# Altium project tester_board.PrjPCB (part 2 of 4)

## Sheet charge_pump.SchDoc: Charge Pump
size A; Engineer: A. Peck; Organization: UCLA High Energy Physics; DocumentNumber: 15; Revision: 3.0; SheetNumber: 15; SheetTotal: 15; Project: LCT Comparator Tester; ProjectName: LCT Comparator Tester
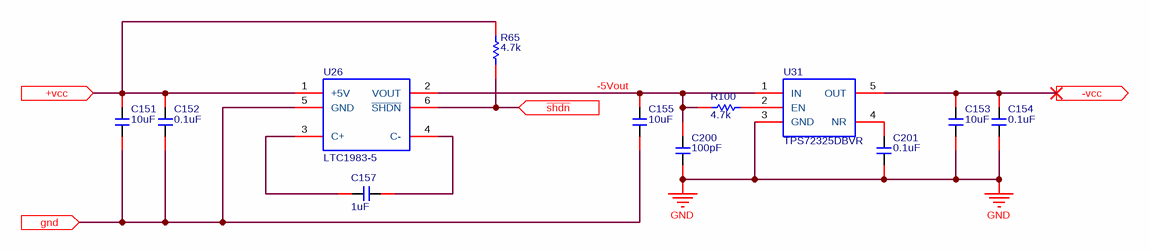
[diagram p3: charge_pump.SchDoc]

### Parts
C151  10uF  [c1206]
C152  0.1uF  [C0603]
C153  10uF  [c1206]
C154  0.1uF  [C0603]
C155  10uF  [c1206]
C157  1uF  [C0603]
C200  100pF  [C0603]
C201  0.1uF  [C0603]
R65  4.7k  [R0603]
R100  4.7k  [R0603]
U26  LTC1983-5  [sot23-6]
U31  TPS72325DBVR  [SOT23-5]

### Ports
+vcc (in), -vcc (out), gnd (in), ~{shdn} (in)

### Nets
+5VA: C151.2 C152.2 R65.2 U26.1(+5V) ; port +vcc
-5VA: C153.2 C154.2 U31.5(OUT) ; port -vcc
GND: C151.1 C152.1 C153.1 C154.1 C155.2 C200.1 C201.1 U26.5(GND) U31.3(GND) ; port gnd
-5Vout: C155.1 C200.2 R100.2 U26.2(VOUT) U31.1(IN)
NetC157_1: C157.1 U26.3(C+)
NetC157_2: C157.2 U26.4(C-)
NetC201_2: C201.2 U31.4(NR)
NetR65_1: R65.1 U26.6(~{SHDN}) ; port ~{shdn}
NetR100_1: R100.1 U31.2(EN)

### Notes on the sheet
- Date:
- Rev:
- of
- Sheet

### Library data of the parts
C151 C153 C155 = CAP/GMK316F106ZL-T: CAP-CER, 2, 10uF, 10%, 35V, 1206; Manufacturer: Taiyo Yuden; Capacitance: 10µF; Tolerance: -20%, +80%; Temperature Coefficient: Y5V (F); Supplier 1: Digi-Key; Supplier Part Number 1: 587-1352-1-ND; Manufacturer Part Number: GMK316F106ZL-T; RoHS: RoHS Compliant; Category: Capacitors; Stock 1: 249989; Pricing 1: 1=0.46, 10=0.345, 50=0.2012, 100=0.161, 250=0.115, 500=0.0782, 1000=0.06325 (USD); Packaging: Cut Tape (CT); Voltage - Rated: 35V; Mounting Type: Surface Mount, MLCC; Operating Temperature: -30°C ~ 85°C; Applications: General Purpose; Ratings: -; Package / Case: 1206 (3216 Metric); Size / Dimension: 0.126" L x 0.063" W (3.20mm x 1.60mm); Height - Seated (Max): -; Thickness (Max): 0.071" (1.80mm); Lead Spacing: -; Features: -; Lead Style: -; ComponentLink1URL: http://ds.yuden.co.jp/TYCOMPAS/ut/detail.do?productNo=GMK316F106ZL-T&fileName=GMK316F106ZL-T_SS&mode=specSheetDownload; ComponentLink1Description: http://ds.yuden.co.jp/TYCOMPAS/ut/detail.do?productNo=GMK316F106ZL-T&fileName=GMK316F106ZL-T_SS&mode=specSheetDownload
C152 C154 C201 = CAP/06035C104KAT2A: CAP-CER, 2, 0.1uF, 10%, 50V, 0603, X7R; Manufacturer: AVX Corporation; Capacitance: 0.10µF; Supplier 1: Digi-Key; Supplier Part Number 1: 478-5052-1-ND; Manufacturer Part Number: 06035C104KAT2A; RoHS: RoHS Compliant; Category: Capacitors; Stock 1: 4412408; Pricing 1: 1=0.1, 10=0.036, 25=0.0264, 50=0.0198, 100=0.0162, 250=0.01352, 500=0.01156, 1000=0.00908 (USD); Packaging: Cut Tape (CT); Tolerance: ±10%; Voltage - Rated: 50V; Temperature Coefficient: X7R; Mounting Type: Surface Mount, MLCC; Operating Temperature: -55°C ~ 125°C; Applications: General Purpose; Ratings: -; Package / Case: 0603 (1608 Metric); Size / Dimension: 0.063" L x 0.032" W (1.60mm x 0.81mm); Height - Seated (Max): -; Thickness (Max): 0.035" (0.90mm); Lead Spacing: -; Features: -; Lead Style: -; ComponentLink1URL: http://datasheets.avx.com/X7RDielectric.pdf; ComponentLink1Description: http://datasheets.avx.com/X7RDielectric.pdf; Supplier 2: Newark; Supplier Part Number 2: 54K2412
C157 = Murata/GRM188R61E105KA12D: CAP-CER, 2, 1.0uF, 10%, 25V, 0603; Manufacturer: Murata Electronics North America; Capacitance: 1µF; Temperature Coefficient: X5R; Supplier 1: Digi-Key; Supplier Part Number 1: 490-3897-1-ND; Manufacturer Part Number: GRM188R61E105KA12D; RoHS: RoHS Compliant; Category: Capacitors; Stock 1: 1899119; Pricing 1: 1=0.1, 10=0.036, 50=0.0196, 100=0.0165, 250=0.01352, 500=0.01156, 1000=0.009 (USD); Packaging: Cut Tape (CT); Tolerance: ±10%; Voltage - Rated: 25V; Mounting Type: Surface Mount, MLCC; Operating Temperature: -55°C ~ 85°C; Applications: General Purpose; Ratings: -; Package / Case: 0603 (1608 Metric); Size / Dimension: 0.063" L x 0.031" W (1.60mm x 0.80mm); Height - Seated (Max): -; Thickness (Max): 0.035" (0.90mm); Lead Spacing: -; Features: -; Lead Style: -; ComponentLink1URL: http://www.murata.com/~/media/webrenewal/support/library/catalog/products/capacitor/mlcc/c02e.pdf; ComponentLink1Description: http://www.murata.com/~/media/webrenewal/support/library/catalog/products/capacitor/mlcc/c02e.pdf
C200 = AVX/06035A101KAT2A: CAP-CER, 0, 100pF, 10%, 50V, 0603; Manufacturer: AVX Corporation; Temperature Coefficient: C0G, NP0; Supplier 1: Digi-Key; Supplier Part Number 1: 478-3717-1-ND; Manufacturer Part Number: 06035A101KAT2A; RoHS: RoHS Compliant; Category: Capacitors; Stock 1: 55355; Pricing 1: 1=0.16, 10=0.117, 25=0.0856, 50=0.0664, 100=0.0551, 250=0.04556, 500=0.03862, 1000=0.03197 (USD); Packaging: Cut Tape (CT); Part Status: Active; Capacitance: 100pF; Tolerance: ±10%; Voltage - Rated: 50V; Operating Temperature: -55°C ~ 125°C; Features: -; Ratings: -; Applications: General Purpose; Failure Rate: *; Mounting Type: Surface Mount, MLCC; Package / Case: 0603 (1608 Metric); Size / Dimension: 0.063" L x 0.032" W (1.60mm x 0.81mm); Height - Seated (Max): -; Thickness (Max): 0.035" (0.90mm); Lead Spacing: -; Lead Style: -; ComponentLink1URL: http://catalogs.avx.com/SurfaceMount.pdf; ComponentLink1Description: http://catalogs.avx.com/SurfaceMount.pdf
R65 R100 = CRCW06034K70FKEA: RES1, SMD, 4.70k, 1.0%, 1/10W, 0603; Manufacturer: Vishay Dale; Tolerance: ±1%; Power (Watts): 0.1W, 1/10W; Temperature Coefficient: ±100ppm/°C; Supplier 1: Digi-Key; Manufacturer Part Number: CRCW06034K70FKEA; RoHS: RoHS Compliant; Category: Resistors; Stock 1: 413202; Pricing 1: 1=0.1, 10=0.03, 25=0.022, 50=0.0168, 100=0.0123, 250=0.0094, 500=0.00752, 1000=0.00554, 2500=0.00481 (USD); Packaging: Cut Tape (CT); Resistance (Ohms): 4.7k; Composition: Thick Film; Features: Automotive AEC-Q200; Operating Temperature: -55°C ~ 155°C; Package / Case: 0603 (1608 Metric); Supplier Device Package: 0603; Size / Dimension: 0.063" L x 0.033" W (1.60mm x 0.85mm); Number of Terminations: 2; ComponentLink1URL: http://www.vishay.com/docs/20035/dcrcwe3.pdf; ComponentLink1Description: http://www.vishay.com/docs/20035/dcrcwe3.pdf; Supplier Part Number 1: 541-4.70KHCT-ND; Part Status: Active; Height - Seated (Max): 0.020" (0.50mm); Failure Rate: -
U26 = LT/LTC1983-5: REG, Charge Pump, Inverting, 100mA, -5V; Manufacturer: Linear Technology; Manufacturer Part Number: LTC1983ES6-5#TRMPBF; Function: Step-Up/Step-Down; Output Configuration: Negative; Output Type: Fixed; Number of Outputs: 1; Voltage - Input (Min): 2.3V; Voltage - Input (Max): 5.5V; Frequency - Switching: 900kHz; Synchronous Rectifier: No; Supplier 1: Digi-Key; RoHS: RoHS Compliant; Category: Integrated Circuits (ICs); Stock 1: 13395; Pricing 1: 1=4.28, 25=3.8192, 100=3.4371 (USD); Packaging: Cut Tape (CT); Topology: Charge Pump; Voltage - Output (Min/Fixed): -5V; Voltage - Output (Max): -; Current - Output: 100mA; Operating Temperature: -40°C ~ 85°C (TA); Mounting Type: Surface Mount; Package / Case: SOT-23-6 Thin, TSOT-23-6; Supplier Device Package: TSOT-23-6; ComponentLink1URL: http://www.linear.com/docs/2135; ComponentLink1Description: http://www.linear.com/docs/2135; Supplier Part Number 1: LTC1983ES6-5#TRMPBFCT-ND
U31 = TPS72325DBVR: LDO, Neg -2.5V, 200mA; Manufacturer: Texas Instruments; Regulator Topology: Negative Fixed; Voltage - Dropout (Typical): 0.28V @ 200mA; Number of Regulators: 1; Voltage - Input: -2.7 V ~ -10 V; Current - Limit (Min): 300mA; Supplier 1: Digi-Key; Manufacturer Part Number: TPS72325DBVR; RoHS: RoHS Compliant; Category: Integrated Circuits (ICs); Stock 1: 2132; Pricing 1: 1=2.87, 10=2.58, 100=2.0696, 500=1.701, 1000=1.18125 (USD); Packaging: Cut Tape (CT); Part Status: Active; Voltage - Output: -2.5V; Current - Output: 200mA; Operating Temperature: -40°C ~ 125°C; Mounting Type: Surface Mount; Package / Case: SC-74A, SOT-753; Supplier Device Package: SOT-23-5; ComponentLink1URL: http://www.ti.com/lit/ds/symlink/tps723.pdf; ComponentLink1Description: http://www.ti.com/lit/ds/symlink/tps723.pdf; Supplier Part Number 1: 296-39479-1-ND

## Sheet spartan6.SchDoc: Spartan-6 FPGA
size B; Engineer: A. Peck; Organization: UCLA High Energy Physics; DocumentNumber: 4; Revision: 3.0; SheetNumber: 4; SheetTotal: 15; Project: LCT Comparator Tester
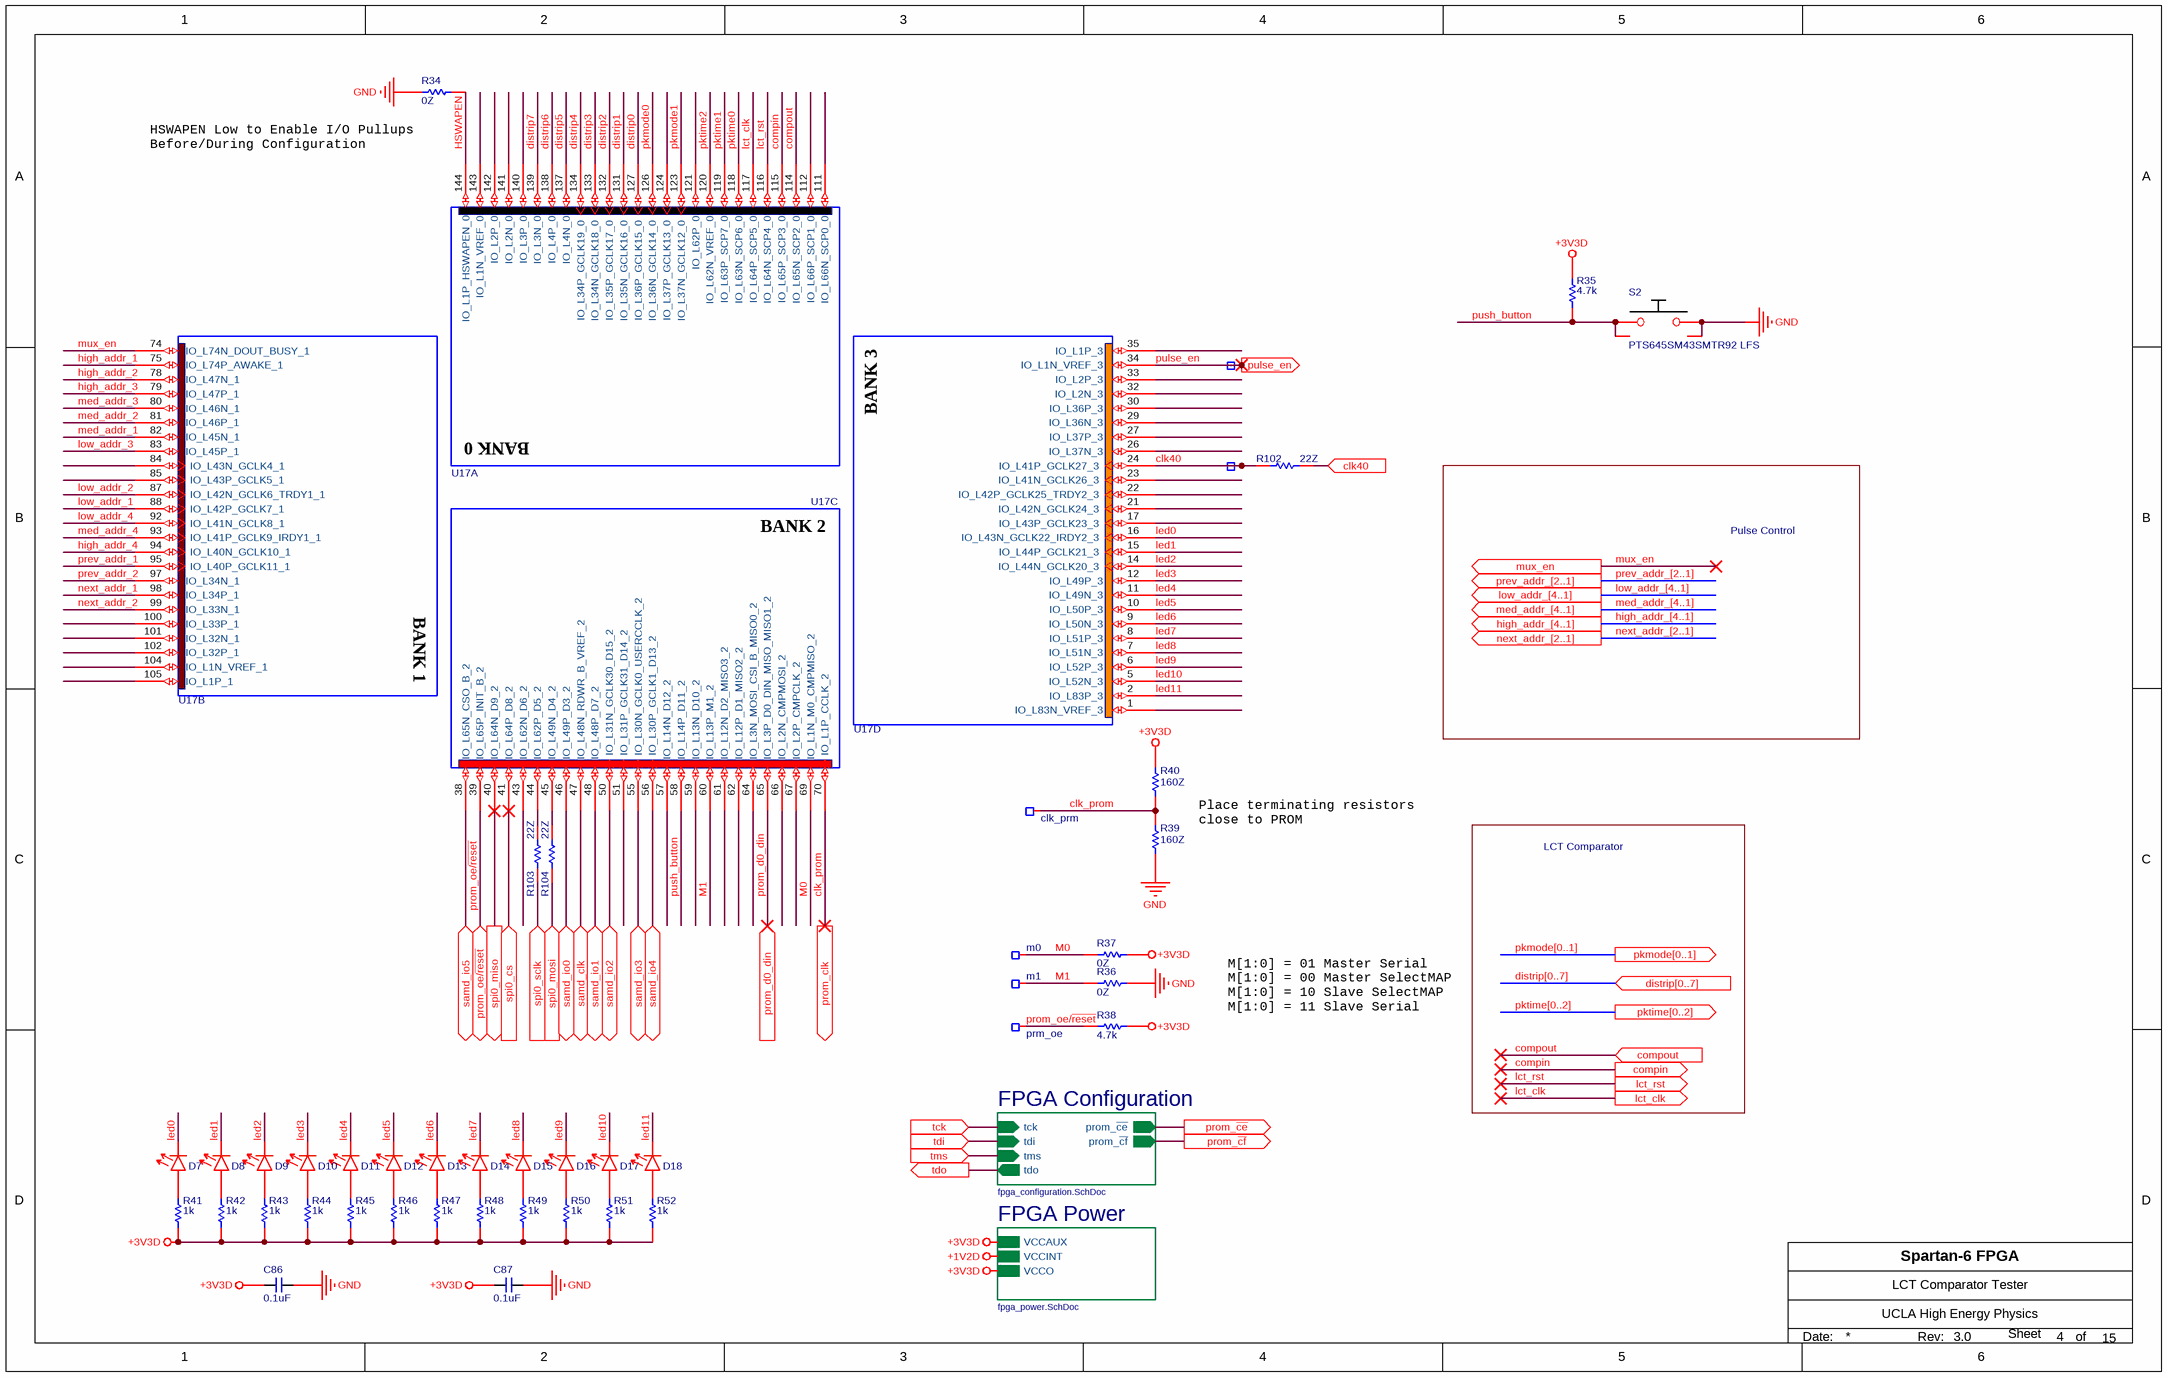
[diagram p4: spartan6.SchDoc]

### Parts
C86  0.1uF  [C0603]
C87  0.1uF  [C0603]
D7  Vishay/TLMS1000-GS08  [LED0603]  (value not drawn)
D8  Vishay/TLMS1000-GS08  [LED0603]  (value not drawn)
D9  Vishay/TLMS1000-GS08  [LED0603]  (value not drawn)
D10  Vishay/TLMS1000-GS08  [LED0603]  (value not drawn)
D11  Vishay/TLMS1000-GS08  [LED0603]  (value not drawn)
D12  Vishay/TLMS1000-GS08  [LED0603]  (value not drawn)
D13  Vishay/TLMS1000-GS08  [LED0603]  (value not drawn)
D14  Vishay/TLMS1000-GS08  [LED0603]  (value not drawn)
D15  Vishay/TLMS1000-GS08  [LED0603]  (value not drawn)
D16  Vishay/TLMS1000-GS08  [LED0603]  (value not drawn)
D17  Vishay/TLMS1000-GS08  [LED0603]  (value not drawn)
D18  Vishay/TLMS1000-GS08  [LED0603]  (value not drawn)
R34  0Z  [R0603]
R35  4.7k  [R0603]
R36  0Z  [R0603]
R37  0Z  [R0603]
R38  4.7k  [R0603]
R39  160Z  [R0603]
R40  160Z  [R0603]
R41  1k  [R0603]
R42  1k  [R0603]
R43  1k  [R0603]
R44  1k  [R0603]
R45  1k  [R0603]
R46  1k  [R0603]
R47  1k  [R0603]
R48  1k  [R0603]
R49  1k  [R0603]
R50  1k  [R0603]
R51  1k  [R0603]
R52  1k  [R0603]
R102  22Z  [R0402]
R103  22Z  [R0402]
R104  22Z  [R0402]
S2  PTS645SM43SMTR92 LFS  [C&K PTS645]
TP22  pulse_en  [TP_MICRO]  (value not drawn)  (no BOM)
TP23  m1  [TP_MICRO]  (no BOM)
TP24  m0  [TP_MICRO]  (no BOM)
TP25  prm_oe  [TP_MICRO]  (no BOM)
TP26  clk_prm  [TP_MICRO]  (no BOM)
TP32  clk40  [TP_MICRO]  (value not drawn)  (no BOM)
U17  XC6SLX4-2TQG144C  [TQFP-144]  (value not drawn)  (parts A,B,C,D of 7)

### Sub-sheets
FPGA Configuration = fpga_configuration.SchDoc: prom_~{ce} (out), prom_~{cf} (out), tck (in), tdi (in), tdo (out), tms (in)
FPGA Power = fpga_power.SchDoc: VCCAUX, VCCINT, VCCO

### Ports
clk40 (in), compin (out), compout (in), distrip[0..7] (in), high_addr_[4..1] (out), lct_clk (out), lct_rst (out), low_addr_[4..1] (out), med_addr_[4..1] (out), mux_en (out), next_addr_[2..1] (out), pkmode[0..1] (out), pktime[0..2] (out), prev_addr_[2..1] (out), prom_clk (out), prom_d0_din (in), prom_oe/~{reset} (bidir), prom_~{ce} (out), prom_~{cf} (out), pulse_en (out), samd_clk (bidir), samd_io0 (bidir), samd_io1 (bidir), samd_io2 (bidir), samd_io3 (bidir), samd_io4 (bidir), samd_io5 (bidir), spi0_cs (in), spi0_miso (out), spi0_mosi (in), spi0_sclk (in), tck (in), tdi (in), tdo (out), tms (in)

### Nets
+3V3D: C86.1 C87.1 R35.2 R37.2 R38.2 R40.1 R41.1 R42.1 R43.1 R44.1 R45.1 R46.1 R47.1 R48.1 R49.1 R50.1 R51.1 R52.1 ; sheet FPGA Power/VCCAUX, sheet FPGA Power/VCCO
GND: C86.2 C87.2 R34.1 R36.2 R39.1 S2.3 S2.4
clk40: R102.1 TP32.1 U17.24(IO_L41P_GCLK27_3)
clk_in: U17.47(IO_L48N_RDWR_B_VREF_2) ; port samd_clk
clk_prom: R39.2 R40.2 TP26.1 U17.70(IO_L1P_CCLK_2) ; port prom_clk
compin: U17.115(IO_L65P_SCP3_0) ; port compin
compout: U17.114(IO_L65N_SCP2_0) ; port compout
distrip0: U17.127(IO_L36P_GCLK15_0)
distrip1: U17.131(IO_L35N_GCLK16_0)
distrip2: U17.132(IO_L35P_GCLK17_0)
distrip3: U17.133(IO_L34N_GCLK18_0)
distrip4: U17.134(IO_L34P_GCLK19_0)
distrip5: U17.137(IO_L4N_0)
distrip6: U17.138(IO_L4P_0)
distrip7: U17.139(IO_L3N_0)
high_addr_1: U17.75(IO_L74P_AWAKE_1)
high_addr_2: U17.78(IO_L47N_1)
high_addr_3: U17.79(IO_L47P_1)
high_addr_4: U17.94(IO_L40N_GCLK10_1)
HSWAPEN: R34.2 U17.144(IO_L1P_HSWAPEN_0)
lct_clk: U17.117(IO_L64P_SCP5_0) ; port lct_clk
lct_rst: U17.116(IO_L64N_SCP4_0) ; port lct_rst
led0: D7.C U17.16(IO_L43N_GCLK22_IRDY2_3)
led1: D8.C U17.15(IO_L44P_GCLK21_3)
led2: D9.C U17.14(IO_L44N_GCLK20_3)
led3: D10.C U17.12(IO_L49P_3)
led4: D11.C U17.11(IO_L49N_3)
led5: D12.C U17.10(IO_L50P_3)
led6: D13.C U17.9(IO_L50N_3)
led7: D14.C U17.8(IO_L51P_3)
led8: D15.C U17.7(IO_L51N_3)
led9: D16.C U17.6(IO_L52P_3)
led10: D17.C U17.5(IO_L52N_3)
led11: D18.C U17.2(IO_L83P_3)
low_addr_1: U17.88(IO_L42P_GCLK7_1)
low_addr_2: U17.87(IO_L42N_GCLK6_TRDY1_1)
low_addr_3: U17.83(IO_L45P_1)
low_addr_4: U17.92(IO_L41N_GCLK8_1)
M0: R37.1 TP24.1 U17.69(IO_L1N_M0_CMPMISO_2)
M1: R36.1 TP23.1 U17.60(IO_L13P_M1_2)
med_addr_1: U17.82(IO_L45N_1)
med_addr_2: U17.81(IO_L46P_1)
med_addr_3: U17.80(IO_L46N_1)
med_addr_4: U17.93(IO_L41P_GCLK9_IRDY1_1)
mux_en: U17.74(IO_L74N_DOUT_BUSY_1) ; port mux_en
next_addr_1: U17.98(IO_L34P_1)
next_addr_2: U17.99(IO_L33N_1)
pkmode0: U17.126(IO_L36N_GCLK14_0)
pkmode1: U17.123(IO_L37N_GCLK12_0)
pktime0: U17.118(IO_L63N_SCP6_0)
pktime1: U17.119(IO_L63P_SCP7_0)
pktime2: U17.120(IO_L62N_VREF_0)
prev_addr_1: U17.95(IO_L40P_GCLK11_1)
prev_addr_2: U17.97(IO_L34N_1)
prom_d0_din: U17.65(IO_L3P_D0_DIN_MISO_MISO1_2) ; port prom_d0_din
prom_oe/~{reset}: R38.1 TP25.1 U17.39(IO_L65P_INIT_B_2) ; port prom_oe/~{reset}
pulse_en: TP22.1 U17.34(IO_L1N_VREF_3) ; port pulse_en
push_button: R35.1 S2.1 S2.2 U17.58(IO_L14P_D11_2)
spi0_~{cs}: U17.41(IO_L64P_D8_2) ; port spi0_cs
spi0_miso: U17.40(IO_L64N_D9_2) ; port spi0_miso
spi0_mosi: R104.1 ; port spi0_mosi
spi0_sclk: R103.1 ; port spi0_sclk
tck: port tck, sheet FPGA Configuration/tck
tdi: port tdi, sheet FPGA Configuration/tdi
tdo1: port tdo, sheet FPGA Configuration/tdo
tms: port tms, sheet FPGA Configuration/tms
NetD7_A: D7.A R41.2
NetD8_A: D8.A R42.2
NetD9_A: D9.A R43.2
NetD10_A: D10.A R44.2
NetD11_A: D11.A R45.2
NetD12_A: D12.A R46.2
NetD13_A: D13.A R47.2
NetD14_A: D14.A R48.2
NetD15_A: D15.A R49.2
NetD16_A: D16.A R50.2
NetD17_A: D17.A R51.2
NetD18_A: D18.A R52.2
NetQ5_1: port prom_~{ce}, sheet FPGA Configuration/prom_~{ce}
NetR63_1: port prom_~{cf}, sheet FPGA Configuration/prom_~{cf}
NetR102_2: R102.2 ; port clk40
NetR103_2: R103.2 U17.44(IO_L62P_D5_2)
NetR104_2: R104.2 U17.45(IO_L49N_D4_2)
NetU17_38: U17.38(IO_L65N_CSO_B_2) ; port samd_io5
NetU17_46: U17.46(IO_L49P_D3_2) ; port samd_io0
NetU17_48: U17.48(IO_L48P_D7_2) ; port samd_io1
NetU17_50: U17.50(IO_L31N_GCLK30_D15_2) ; port samd_io2
NetU17_55: U17.55(IO_L30N_GCLK0_USERCCLK_2) ; port samd_io3
NetU17_56: U17.56(IO_L30P_GCLK1_D13_2) ; port samd_io4

Not connected (* = marked no-connect by the designer): U17 1(IO_L83N_VREF_3) 17(IO_L43P_GCLK23_3) 21(IO_L42N_GCLK24_3) 22(IO_L42P_GCLK25_TRDY2_3) 23(IO_L41N_GCLK26_3) 26(IO_L37N_3) 27(IO_L37P_3) 29(IO_L36N_3) 30(IO_L36P_3) 32(IO_L2N_3) 33(IO_L2P_3) 35(IO_L1P_3) 43(IO_L62N_D6_2) 51(IO_L31P_GCLK31_D14_2) 57(IO_L14N_D12_2) 59(IO_L13N_D10_2) 61(IO_L12N_D2_MISO3_2) 62(IO_L12P_D1_MISO2_2) 64(IO_L3N_MOSI_CSI_B_MISO0_2) 66(IO_L2N_CMPMOSI_2) 67(IO_L2P_CMPCLK_2) 84(IO_L43N_GCLK4_1) 85(IO_L43P_GCLK5_1) 100(IO_L33P_1) 101(IO_L32N_1) 102(IO_L32P_1) 104(IO_L1N_VREF_1) 105(IO_L1P_1) 111(IO_L66N_SCP0_0) 112(IO_L66P_SCP1_0) 121(IO_L62P_0) 124(IO_L37P_GCLK13_0) 140(IO_L3P_0) 141(IO_L2N_0) 142(IO_L2P_0) 143(IO_L1N_VREF_0)

### Buses and harness runs
bus distrip[0..7] = port distrip[0..7]
bus high_addr_[4..1] = port high_addr_[4..1]
bus low_addr_[4..1] = port low_addr_[4..1]
bus med_addr_[4..1] = port med_addr_[4..1]
bus next_addr_[2..1] = port next_addr_[2..1]
bus pkmode[0..1] = port pkmode[0..1]
bus pktime[0..2] = port pktime[0..2]
bus prev_addr_[2..1] = port prev_addr_[2..1]

### Notes on the sheet
- HSWAPEN Low to Enable I/O Pullups Before/During Configuration
- Pulse Control
- Place terminating resistors
  close to PROM
- LCT Comparator
- M[1:0] = 01 Master Serial
  M[1:0] = 00 Master SelectMAP
  M[1:0] = 10 Slave SelectMAP
  M[1:0] = 11 Slave Serial
- Date:
- Rev:
- of
- Sheet
- (in symbol Xilinx/FPGA-XSP6-XC6SLX9-SQ144, part A) BANK 0
- (in symbol Xilinx/FPGA-XSP6-XC6SLX9-SQ144, part B) BANK 1
- (in symbol Xilinx/FPGA-XSP6-XC6SLX9-SQ144, part C) BANK 2
- (in symbol Xilinx/FPGA-XSP6-XC6SLX9-SQ144, part D) BANK 3

### Library data of the parts
C86 C87 = CAP/06035C104KAT2A: as C152 on sheet charge_pump; Supplier 1: Digi-Key; Manufacturer Part Number: 06035C104KAT2A; RoHS: RoHS Compliant; Category: Capacitors; Stock 1: 4412408; Pricing 1: 1=0.1, 10=0.036, 25=0.0264, 50=0.0198, 100=0.0162, 250=0.01352, 500=0.01156, 1000=0.00908 (USD); Packaging: Cut Tape (CT); Tolerance: ±10%; Voltage - Rated: 50V; Temperature Coefficient: X7R; Mounting Type: Surface Mount, MLCC; Operating Temperature: -55°C ~ 125°C; Applications: General Purpose; Ratings: -; Package / Case: 0603 (1608 Metric); Size / Dimension: 0.063" L x 0.032" W (1.60mm x 0.81mm); Height - Seated (Max): -; Thickness (Max): 0.035" (0.90mm); Lead Spacing: -; Features: -; Lead Style: -; ComponentLink1URL: http://datasheets.avx.com/X7RDielectric.pdf; ComponentLink1Description: http://datasheets.avx.com/X7RDielectric.pdf; Supplier 2: Newark; Supplier Part Number 1: 478-5052-1-ND; Supplier Part Number 2: 54K2412
D7-D18 = Vishay/TLMS1000-GS08: LED, 2mA, 0603, Red; Manufacturer: Vishay Semiconductor Opto Division; Millicandela Rating: 4mcd; Lens Style/Size: Rectangle with Flat Top, 1.60mm x 0.80mm; Voltage - Forward (Vf) (Typ): 1.8V; Viewing Angle: 160°; Wavelength - Dominant: 628nm; Wavelength - Peak: 640nm; Supplier 1: Digi-Key; Manufacturer Part Number: TLMS1000-GS08; RoHS: RoHS Compliant; Category: Optoelectronics; Stock 1: 12598; Pricing 1: 1=0.52, 10=0.372, 25=0.304, 100=0.2432, 250=0.20524, 500=0.17482, 1000=0.13682 (USD); Packaging: Cut Tape (CT); Color: Red; Lens Color: -; Lens Transparency: -; Current - Test: 2mA; Mounting Type: Surface Mount; Features: -; Package / Case: 0603 (1608 Metric); Supplier Device Package: 0603; Size / Dimension: 1.60mm L x 0.80mm W; Height (Max): 0.65mm; ComponentLink1URL: http://www.vishay.com/docs/83172/tlmo1000.pdf; ComponentLink1Description: http://www.vishay.com/docs/83172/tlmo1000.pdf; Supplier 2: Newark; Supplier Part Number 1: TLMS1000-GS08CT-ND; Supplier Part Number 2: 35M3052
R34 R36 R37 = CRCW06030000Z0EA: RES0, SMD, 0.00Z, 0603; Manufacturer: Vishay Dale; Resistance (Ohms): 0.0; Tolerance: Jumper; Power (Watts): 0.1W, 1/10W; Manufacturer Part Number: CRCW06030000Z0EA; RoHS: RoHS Compliant; Category: Resistors; Packaging: Cut Tape (CT); Composition: Thick Film; Features: Automotive AEC-Q200; Temperature Coefficient: -; Operating Temperature: -55°C ~ 155°C; Package / Case: 0603 (1608 Metric); Supplier Device Package: 0603; Size / Dimension: 0.061" L x 0.033" W (1.55mm x 0.85mm); Height: 0.020" (0.50mm); Number of Terminations: 2; ComponentLink1URL: http://www.vishay.com/docs/20035/dcrcwe3.pdf; ComponentLink1Description: http://www.vishay.com/docs/20035/dcrcwe3.pdf; Supplier 1: Digi-Key; Stock 1: 3403646; Pricing 1: 1=0.1, 10=0.022, 25=0.016, 50=0.0124, 100=0.0091, 250=0.00692, 500=0.00554, 1000=0.00408, 2500=0.00354 (USD); Supplier Part Number 1: 541-0.0GCT-ND; Supplier 2: Newark; Supplier Part Number 2: 52K8014
R35 R38 = CRCW06034K70FKEA: as R65 on sheet charge_pump; Supplier 1: Digi-Key; Supplier Part Number 1: 541-4.70KHCT-ND; Manufacturer Part Number: CRCW06034K70FKEA; RoHS: RoHS Compliant; Category: Resistors; Packaging: Cut Tape (CT); Part Status: Active; Resistance (Ohms): 4.7k; Composition: Thick Film; Features: Automotive AEC-Q200; Operating Temperature: -55°C ~ 155°C; Package / Case: 0603 (1608 Metric); Supplier Device Package: 0603; Size / Dimension: 0.063" L x 0.033" W (1.60mm x 0.85mm); Height - Seated (Max): 0.020" (0.50mm); Number of Terminations: 2; Failure Rate: -; ComponentLink1URL: http://www.vishay.com/docs/20035/dcrcwe3.pdf; ComponentLink1Description: http://www.vishay.com/docs/20035/dcrcwe3.pdf; Stock 1: 413202; Pricing 1: 1=0.1, 10=0.03, 25=0.022, 50=0.0168, 100=0.0123, 250=0.0094, 500=0.00752, 1000=0.00554, 2500=0.00481 (USD)
R39 R40 = CRCW0603160RFKEA: RES0, SMD,  160Z, 1.0%, 1/10W, 0603; Manufacturer: Vishay Dale; Resistance (Ohms): 160; Tolerance: ±1%; Power (Watts): 0.1W, 1/10W; Temperature Coefficient: ±100ppm/°C; Supplier 1: Digi-Key; Manufacturer Part Number: CRCW0603160RFKEA; RoHS: RoHS Compliant; Category: Resistors; Stock 1: 48671; Pricing 1: 1=0.1, 10=0.03, 25=0.022, 50=0.0168, 100=0.0123, 250=0.0094, 500=0.00752, 1000=0.00554, 2500=0.00481 (USD); Packaging: Cut Tape (CT); Part Status: Active; Composition: Thick Film; Features: Automotive AEC-Q200; Operating Temperature: -55°C ~ 155°C; Package / Case: 0603 (1608 Metric); Supplier Device Package: 0603; Size / Dimension: 0.063" L x 0.033" W (1.60mm x 0.85mm); Height - Seated (Max): 0.020" (0.50mm); Number of Terminations: 2; Failure Rate: -; ComponentLink1URL: http://www.vishay.com/docs/20035/dcrcwe3.pdf; ComponentLink1Description: http://www.vishay.com/docs/20035/dcrcwe3.pdf; Supplier Part Number 1: 541-160HCT-ND
R41-R52 = CRCW06031K00FKEA: RES1, SMD, 1.00k, 1.0%, 1/10W, 0603; Manufacturer: Vishay Dale; Tolerance: ±1%; Power (Watts): 0.1W, 1/10W; Temperature Coefficient: ±100ppm/°C; Supplier 1: Digi-Key; Supplier Part Number 1: 541-1.00KHCT-ND; Manufacturer Part Number: CRCW06031K00FKEA; RoHS: RoHS Compliant; Category: Resistors; Stock 1: 770011; Pricing 1: 1=0.1, 10=0.03, 25=0.022, 50=0.0168, 100=0.0123, 250=0.0094, 500=0.00752, 1000=0.00554, 2500=0.00481 (USD); Packaging: Cut Tape (CT); Resistance (Ohms): 1k; Composition: Thick Film; Features: Automotive AEC-Q200; Operating Temperature: -55°C ~ 155°C; Package / Case: 0603 (1608 Metric); Supplier Device Package: 0603; Size / Dimension: 0.061" L x 0.033" W (1.55mm x 0.85mm); Height: 0.020" (0.50mm); Number of Terminations: 2; ComponentLink1URL: http://www.vishay.com/docs/20035/dcrcwe3.pdf; ComponentLink1Description: http://www.vishay.com/docs/20035/dcrcwe3.pdf; Supplier 2: Newark; Supplier Part Number 2: 52K8015
R102-R104 = RES/ 311-22.0LRCT-ND: RES0, SMD, 22.0Z, 1.0%, 1/16W, 0402; Manufacturer: Yageo; Manufacturer Part Number: RC0402FR-0722RL; Resistance (Ohms): 22; Tolerance: ±1%; Power (Watts): 0.063W, 1/16W; Temperature Coefficient: ±100ppm/°C; RoHS: RoHS Compliant; Category: Resistors; Packaging: Cut Tape (CT); Composition: Thick Film; Features: Moisture Resistant; Operating Temperature: -55°C ~ 155°C; Package / Case: 0402 (1005 Metric); Supplier Device Package: 0402; Size / Dimension: 0.039" L x 0.020" W (1.00mm x 0.50mm); Height: 0.016" (0.40mm); Number of Terminations: 2; ComponentLink1URL: http://www.yageo.com/documents/recent/PYu-RC_Group_51_RoHS_L_04.pdf; ComponentLink1Description: http://www.yageo.com/documents/recent/PYu-RC_Group_51_RoHS_L_04.pdf; Supplier 1: Digi-Key; Stock 1: 1724839; Pricing 1: 1=0.1, 10=0.013, 25=0.0096, 100=0.0054, 250=0.00412, 500=0.00328, 1000=0.00242, 2500=0.0021, 5000=0.00173 (USD); Supplier Part Number 1: 311-22.0LRCT-ND; Supplier 2: Newark; Supplier Part Number 2: 67R9912
S2 = C&K/PTS645SM43SMTR92 LFS: Button, Switch SPST-NO, PCB; Manufacturer: C&K Components; Switch Function: Off-Mom; Contact Rating @ Voltage: 0.05A @ 12VDC; Actuator Type: Standard; Actuator Height off PCB, from Pins: 4.30mm; Actuator Orientation: Top Actuated; Outline: 6.00mm x 6.00mm; Illumination: Non-Illuminated; Operating Force: 160gf; Actuator Material: Polyamide (PA66), Nylon 6/6; Mechanical Life: 100,000 Cycles; Supplier 1: Digi-Key; Manufacturer Part Number: PTS645SM43SMTR92 LFS; RoHS: RoHS Compliant; Category: Switches; Stock 1: 434807; Pricing 1: 1=0.17, 10=0.161, 25=0.156, 50=0.1502, 100=0.1419, 250=0.1336, 500=0.12802 (USD); Packaging: Cut Tape (CT); Part Status: Active; Circuit: SPST-NO; Mounting Type: Surface Mount; Termination Style: Gull Wing; Illumination Voltage (Nominal): -; Illumination Type, Color: -; Ingress Protection: -; Features: Blue Actuator; Switch Travel: -; Operating Temperature: -20°C ~ 60°C; ComponentLink1URL: http://media.digikey.com/pdf/Data%20Sheets/C&K/PTS645_Series.pdf; ComponentLink1Description: http://media.digikey.com/pdf/Data%20Sheets/C&K/PTS645_Series.pdf; Supplier Part Number 1: CKN9112CT-ND
TP22-TP26 TP32 = TP_MICRO: Test Point, Round, Small
U17 = Xilinx/FPGA-XSP6-XC6SLX9-SQ144: FPGA, Spartan-6 LX 1.2V, 102 User I/Os, 144-Pin TQFP (0.5mm Pitch), Speed Grade 2, Commercial Grade, Pb-Free; PackageReference: TQG144; Code_JEDEC: MS-026-BFB; DatasheetVersion: ver1.6, Nov-2010; PackageVersion: ver1.2, Jun-2004; PackageDescription: 144-Pin Thin Quad Flat Pack (TQG144) - Pb-Free; Supplier 1: Digi-Key; Supplier Part Number 1: 122-1734-ND

## Sheet fpga_configuration.SchDoc: Spartan-6 FPGA Configuration
size A; Engineer: A. Peck; Organization: UCLA High Energy Physics; DocumentNumber: 5; Revision: 3.0; SheetNumber: 5; SheetTotal: 15; Project: LCT Comparator Tester
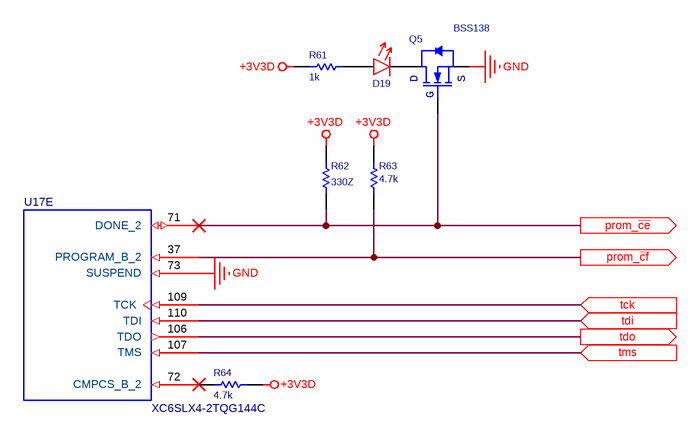
[diagram p5: fpga_configuration.SchDoc]

### Parts
D19  LITEON/LTST-C171KRKT  [LED0805]  (value not drawn)
Q5  BSS138  [SOT23]
R61  1k  [R0603]
R62  330Z  [R0603]
R63  4.7k  [R0603]
R64  4.7k  [R0603]
U17  XC6SLX4-2TQG144C  [TQFP-144]  (value not drawn)  (part E of 7)

### Ports
prom_~{ce} (out), prom_~{cf} (out), tck (in), tdi (in), tdo (out), tms (in)

### Nets
+3V3D: R61.1 R62.2 R63.2 R64.2
GND: Q5.2(S) U17.73(SUSPEND)
tck: U17.109(TCK) ; port tck
tdi: U17.110(TDI) ; port tdi
tdo1: U17.106(TDO) ; port tdo
tms: U17.107(TMS) ; port tms
NetD19_A: D19.A R61.2
NetD19_C: D19.C Q5.3(D)
NetQ5_1: Q5.1(G) R62.1 U17.71(DONE_2) ; port prom_~{ce}
NetR63_1: R63.1 U17.37(PROGRAM_B_2) ; port prom_~{cf}
NetR64_1: R64.1 U17.72(CMPCS_B_2)

### Notes on the sheet
- Date:
- Rev:
- of
- Sheet

### Library data of the parts
D19 = LITEON/LTST-C171KRKT: LED, 20mA, 0805, Red; Supplier 1: Digi-Key; Supplier Part Number 1: 160-1427-1-ND
Q5 = Fairchild/BSS138: Trans, nFet, 50V, 220mA, SOT-23; Manufacturer: Fairchild Semiconductor; FET Type: MOSFET N-Channel, Metal Oxide; FET Feature: Logic Level Gate; Current - Continuous Drain (Id) @ 25°C: 220mA (Ta); Rds On (Max) @ Id, Vgs: 3.5 Ohm @ 220mA, 10V; Vgs(th) (Max) @ Id: 1.5V @ 1mA; Gate Charge (Qg) @ Vgs: 2.4nC @ 10V; Input Capacitance (Ciss) @ Vds: 27pF @ 25V; Power - Max: 360mW; Supplier 1: Digi-Key; Manufacturer Part Number: BSS138; RoHS: RoHS Compliant; Category: Discrete Semiconductor Products; Stock 1: 524637; Pricing 1: 1=0.22, 10=0.178, 100=0.0945, 500=0.06214, 1000=0.04234 (USD); Packaging: Cut Tape (CT); Drain to Source Voltage (Vdss): 50V; Operating Temperature: -55°C ~ 150°C (TJ); Mounting Type: Surface Mount; Package / Case: TO-236-3, SC-59, SOT-23-3; Supplier Device Package: SOT-23-3; ComponentLink1URL: http://www.fairchildsemi.com/datasheets/BS/BSS138.pdf; ComponentLink1Description: http://www.fairchildsemi.com/datasheets/BS/BSS138.pdf; Supplier 2: Newark; Supplier Part Number 1: BSS138CT-ND; Supplier Part Number 2: 58K8769
R61 = CRCW06031K00FKEA: as R41 on sheet spartan6; Supplier 1: Digi-Key; Manufacturer Part Number: CRCW06031K00FKEA; RoHS: RoHS Compliant; Category: Resistors; Stock 1: 770011; Pricing 1: 1=0.1, 10=0.03, 25=0.022, 50=0.0168, 100=0.0123, 250=0.0094, 500=0.00752, 1000=0.00554, 2500=0.00481 (USD); Packaging: Cut Tape (CT); Resistance (Ohms): 1k; Composition: Thick Film; Features: Automotive AEC-Q200; Operating Temperature: -55°C ~ 155°C; Package / Case: 0603 (1608 Metric); Supplier Device Package: 0603; Size / Dimension: 0.061" L x 0.033" W (1.55mm x 0.85mm); Height: 0.020" (0.50mm); Number of Terminations: 2; ComponentLink1URL: http://www.vishay.com/docs/20035/dcrcwe3.pdf; ComponentLink1Description: http://www.vishay.com/docs/20035/dcrcwe3.pdf; Supplier Part Number 1: 541-1.00KHCT-ND; Supplier 2: Newark; Supplier Part Number 2: 52K8015
R62 = CRCW0603330RFKEA: RES0, SMD,  330Z, 1.0%, 1/10W, 0603; Manufacturer: Rohm Semiconductor; Manufacturer Part Number: MCR03ERTF3300; Resistance (Ohms): 330; Tolerance: ±1%; Power (Watts): 0.1W, 1/10W; Temperature Coefficient: ±100ppm/°C; Supplier 1: Digi-Key; RoHS: RoHS Compliant; Category: Resistors; Stock 1: 139947; Pricing 1: 1=0.1, 10=0.011, 25=0.0084, 100=0.0047, 250=0.00356, 500=0.00286, 1000=0.0021 (USD); Packaging: Cut Tape (CT); Composition: Thick Film; Features: -; Operating Temperature: -55°C ~ 155°C; Package / Case: 0603 (1608 Metric); Supplier Device Package: 0603 (1608 Metric); Size / Dimension: 0.063" L x 0.031" W (1.60mm x 0.80mm); Height: 0.022" (0.55mm); Number of Terminations: 2; ComponentLink1URL: http://rohmfs.rohm.com/en/products/databook/datasheet/passive/resistor/chip_resistor/mcr_g.pdf; ComponentLink1Description: http://rohmfs.rohm.com/en/products/databook/datasheet/passive/resistor/chip_resistor/mcr_g.pdf; Supplier Part Number 1: RHM330CFCT-ND
R63 R64 = CRCW06034K70FKEA: as R65 on sheet charge_pump; Supplier 1: Digi-Key; Supplier Part Number 1: 541-4.70KHCT-ND; Manufacturer Part Number: CRCW06034K70FKEA; RoHS: RoHS Compliant; Category: Resistors; Packaging: Cut Tape (CT); Part Status: Active; Resistance (Ohms): 4.7k; Composition: Thick Film; Features: Automotive AEC-Q200; Operating Temperature: -55°C ~ 155°C; Package / Case: 0603 (1608 Metric); Supplier Device Package: 0603; Size / Dimension: 0.063" L x 0.033" W (1.60mm x 0.85mm); Height - Seated (Max): 0.020" (0.50mm); Number of Terminations: 2; Failure Rate: -; ComponentLink1URL: http://www.vishay.com/docs/20035/dcrcwe3.pdf; ComponentLink1Description: http://www.vishay.com/docs/20035/dcrcwe3.pdf; Stock 1: 413202; Pricing 1: 1=0.1, 10=0.03, 25=0.022, 50=0.0168, 100=0.0123, 250=0.0094, 500=0.00752, 1000=0.00554, 2500=0.00481 (USD)
U17 = Xilinx/FPGA-XSP6-XC6SLX9-SQ144: as U17 on sheet spartan6; PackageReference: TQG144; Code_JEDEC: MS-026-BFB; DatasheetVersion: ver1.6, Nov-2010; PackageVersion: ver1.2, Jun-2004; PackageDescription: 144-Pin Thin Quad Flat Pack (TQG144) - Pb-Free; Supplier 1: Digi-Key; Supplier Part Number 1: 122-1734-ND

## Sheet fpga_power.SchDoc: Spartan-6 FPGA Power
size A; Engineer: A. Peck; Organization: UCLA High Energy Physics; DocumentNumber: 6; Revision: 3.0; SheetNumber: 6; SheetTotal: 15; Project: LCT Comparator Tester
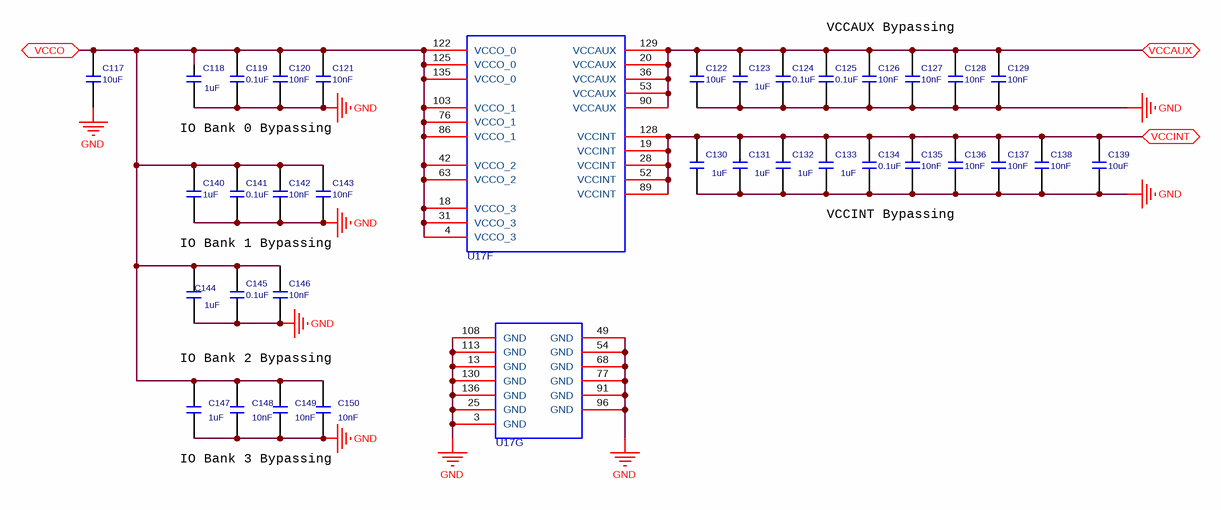
[diagram p6: fpga_power.SchDoc]

### Parts
C117  10uF  [c1206]
C118  1uF  [C0603]
C119  0.1uF  [C0603]
C120  10nF  [C0603]
C121  10nF  [C0603]
C122  10uF  [c1206]
C123  1uF  [C0603]
C124  0.1uF  [C0603]
C125  0.1uF  [C0603]
C126  10nF  [C0603]
C127  10nF  [C0603]
C128  10nF  [C0603]
C129  10nF  [C0603]
C130  1uF  [C0603]
C131  1uF  [C0603]
C132  1uF  [C0603]
C133  1uF  [C0603]
C134  0.1uF  [C0603]
C135  10nF  [C0603]
C136  10nF  [C0603]
C137  10nF  [C0603]
C138  10nF  [C0603]
C139  10uF  [c1206]
C140  1uF  [C0603]
C141  0.1uF  [C0603]
C142  10nF  [C0603]
C143  10nF  [C0603]
C144  1uF  [C0603]
C145  0.1uF  [C0603]
C146  10nF  [C0603]
C147  1uF  [C0603]
C148  10nF  [C0603]
C149  10nF  [C0603]
C150  10nF  [C0603]
U17  XC6SLX4-2TQG144C  [TQFP-144]  (value not drawn)  (parts F,G of 7)

### Ports
VCCAUX, VCCINT, VCCO

### Nets
+1V2D: C130.1 C131.1 C132.1 C133.1 C134.1 C135.2 C136.2 C137.2 C138.2 C139.2 U17.19(VCCINT) U17.28(VCCINT) U17.52(VCCINT) U17.89(VCCINT) U17.128(VCCINT) ; port VCCINT
+3V3D: C117.2 C118.1 C119.2 C120.2 C121.2 C122.2 C123.1 C124.2 C125.2 C126.2 C127.2 C128.2 C129.2 C140.1 C141.2 C142.2 C143.2 C144.1 C145.2 C146.2 C147.1 C148.2 C149.2 C150.2 U17.4(VCCO_3) U17.18(VCCO_3) U17.20(VCCAUX) U17.31(VCCO_3) U17.36(VCCAUX) U17.42(VCCO_2) U17.53(VCCAUX) U17.63(VCCO_2) U17.76(VCCO_1) U17.86(VCCO_1) U17.90(VCCAUX) U17.103(VCCO_1) U17.122(VCCO_0) U17.125(VCCO_0) U17.129(VCCAUX) U17.135(VCCO_0) ; port VCCAUX, port VCCO
GND: C117.1 C118.2 C119.1 C120.1 C121.1 C122.1 C123.2 C124.1 C125.1 C126.1 C127.1 C128.1 C129.1 C130.2 C131.2 C132.2 C133.2 C134.2 C135.1 C136.1 C137.1 C138.1 C139.1 C140.2 C141.1 C142.1 C143.1 C144.2 C145.1 C146.1 C147.2 C148.1 C149.1 C150.1 U17.3(GND) U17.13(GND) U17.25(GND) U17.49(GND) U17.54(GND) U17.68(GND) U17.77(GND) U17.91(GND) U17.96(GND) U17.108(GND) U17.113(GND) U17.130(GND) U17.136(GND)

### Notes on the sheet
- VCCAUX Bypassing
- IO Bank 0 Bypassing
- VCCINT Bypassing
- IO Bank 1 Bypassing
- IO Bank 2 Bypassing
- IO Bank 3 Bypassing
- Date:
- Rev:
- of
- Sheet

### Library data of the parts
C117 C122 C139 = CAP/GMK316F106ZL-T: as C151 on sheet charge_pump; Supplier 1: Digi-Key; Manufacturer Part Number: GMK316F106ZL-T; RoHS: RoHS Compliant; Category: Capacitors; Stock 1: 249989; Pricing 1: 1=0.46, 10=0.345, 50=0.2012, 100=0.161, 250=0.115, 500=0.0782, 1000=0.06325 (USD); Packaging: Cut Tape (CT); Voltage - Rated: 35V; Mounting Type: Surface Mount, MLCC; Operating Temperature: -30°C ~ 85°C; Applications: General Purpose; Ratings: -; Package / Case: 1206 (3216 Metric); Size / Dimension: 0.126" L x 0.063" W (3.20mm x 1.60mm); Height - Seated (Max): -; Thickness (Max): 0.071" (1.80mm); Lead Spacing: -; Features: -; Lead Style: -; ComponentLink1URL: http://ds.yuden.co.jp/TYCOMPAS/ut/detail.do?productNo=GMK316F106ZL-T&fileName=GMK316F106ZL-T_SS&mode=specSheetDownload; ComponentLink1Description: http://ds.yuden.co.jp/TYCOMPAS/ut/detail.do?productNo=GMK316F106ZL-T&fileName=GMK316F106ZL-T_SS&mode=specSheetDownload; Supplier Part Number 1: 587-1352-1-ND
C118 C123 C130-C133 C140 C144 C147 = Murata/GRM188R61E105KA12D: as C157 on sheet charge_pump; Supplier 1: Digi-Key; Manufacturer Part Number: GRM188R61E105KA12D; RoHS: RoHS Compliant; Category: Capacitors; Packaging: Cut Tape (CT); Tolerance: ±10%; Voltage - Rated: 25V; Mounting Type: Surface Mount, MLCC; Operating Temperature: -55°C ~ 85°C; Package / Case: 0603 (1608 Metric); Size / Dimension: 0.063" L x 0.031" W (1.60mm x 0.80mm); Height - Seated (Max): -; Lead Spacing: -; Features: -; ComponentLink1URL: http://www.murata.com/~/media/webrenewal/support/library/catalog/products/capacitor/mlcc/c02e.pdf; ComponentLink1Description: http://www.murata.com/~/media/webrenewal/support/library/catalog/products/capacitor/mlcc/c02e.pdf; Supplier Part Number 1: 490-3897-1-ND; Stock 1: 1899119; Pricing 1: 1=0.1, 10=0.036, 50=0.0196, 100=0.0165, 250=0.01352, 500=0.01156, 1000=0.009 (USD); Applications: General Purpose; Ratings: -; Thickness (Max): 0.035" (0.90mm); Lead Style: -
C119 C124 C125 C134 C141 C145 = CAP/06035C104KAT2A: as C152 on sheet charge_pump; Supplier 1: Digi-Key; Supplier Part Number 1: 478-5052-1-ND; Manufacturer Part Number: 06035C104KAT2A; RoHS: RoHS Compliant; Category: Capacitors; Stock 1: 4412408; Pricing 1: 1=0.1, 10=0.036, 25=0.0264, 50=0.0198, 100=0.0162, 250=0.01352, 500=0.01156, 1000=0.00908 (USD); Packaging: Cut Tape (CT); Tolerance: ±10%; Voltage - Rated: 50V; Temperature Coefficient: X7R; Mounting Type: Surface Mount, MLCC; Operating Temperature: -55°C ~ 125°C; Applications: General Purpose; Ratings: -; Package / Case: 0603 (1608 Metric); Size / Dimension: 0.063" L x 0.032" W (1.60mm x 0.81mm); Height - Seated (Max): -; Thickness (Max): 0.035" (0.90mm); Lead Spacing: -; Features: -; Lead Style: -; ComponentLink1URL: http://datasheets.avx.com/X7RDielectric.pdf; ComponentLink1Description: http://datasheets.avx.com/X7RDielectric.pdf; Supplier 2: Newark; Supplier Part Number 2: 54K2412
C120 C121 C126-C129 C135-C138 C142 C143 C146 C148-C150 = CAP/GRM188R71H103KA01D: CAP-CER, 2, 0.01uF, 10%, 50V, X7R, 0603; Manufacturer: Murata Electronics North America; Capacitance: 10000pF; Supplier 1: Digi-Key; Manufacturer Part Number: GRM188R71H103KA01D; RoHS: RoHS Compliant; Category: Capacitors; Stock 1: 3035311; Pricing 1: 1=0.1, 10=0.019, 50=0.01, 100=0.0085, 250=0.00696, 500=0.00596, 1000=0.00465 (USD); Packaging: Cut Tape (CT); Tolerance: ±10%; Voltage - Rated: 50V; Temperature Coefficient: X7R; Mounting Type: Surface Mount, MLCC; Operating Temperature: -55°C ~ 125°C; Applications: General Purpose; Ratings: -; Package / Case: 0603 (1608 Metric); Size / Dimension: 0.063" L x 0.031" W (1.60mm x 0.80mm); Height - Seated (Max): -; Thickness (Max): 0.035" (0.90mm); Lead Spacing: -; Features: -; Lead Style: -; ComponentLink1URL: http://www.murata.com/~/media/webrenewal/support/library/catalog/products/capacitor/mlcc/c02e.pdf; ComponentLink1Description: http://www.murata.com/~/media/webrenewal/support/library/catalog/products/capacitor/mlcc/c02e.pdf; Supplier Part Number 1: 490-1512-1-ND; Supplier 2: Newark; Supplier Part Number 2: 38K1669
U17 = Xilinx/FPGA-XSP6-XC6SLX9-SQ144: as U17 on sheet spartan6; PackageReference: TQG144; Code_JEDEC: MS-026-BFB; DatasheetVersion: ver1.6, Nov-2010; PackageVersion: ver1.2, Jun-2004; PackageDescription: 144-Pin Thin Quad Flat Pack (TQG144) - Pb-Free; Supplier 1: Digi-Key; Supplier Part Number 1: 122-1734-ND

## Sheet prom.SchDoc: PROM
size A; Engineer: A. Peck; Organization: UCLA High Energy Physics; DocumentNumber: 7; Revision: 3.0; SheetNumber: 7; SheetTotal: 15; Project: LCT Comparator Tester
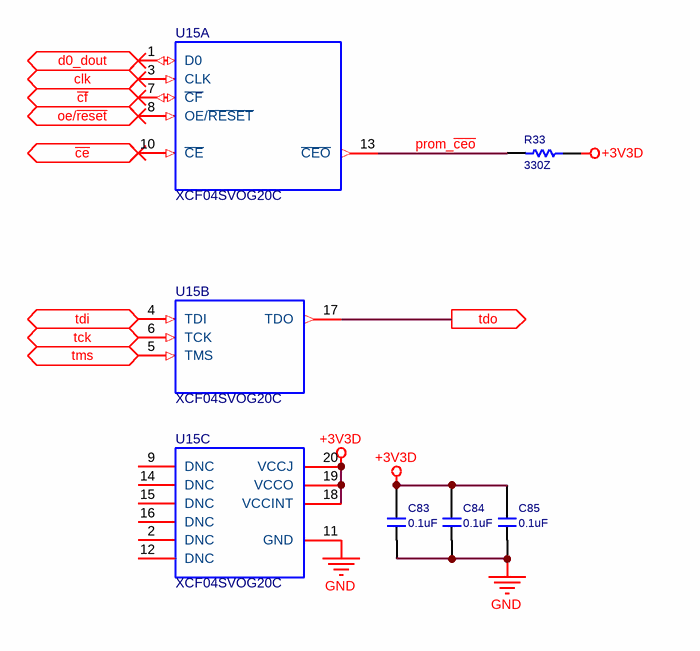
[diagram p7: prom.SchDoc]

### Parts
C83  0.1uF  [C0603]
C84  0.1uF  [C0603]
C85  0.1uF  [C0603]
R33  330Z  [R0603]
U15  XCF04SVOG20C  [R-PDSO-G20]  (parts A,B,C of 3)

### Ports
clk (in), d0_dout (out), oe/~{reset} (in), tck (in), tdi (in), tdo (out), tms (in), ~{ce} (in), ~{cf} (in)

### Nets
+3V3D: C83.2 C84.2 C85.2 R33.1 U15.18(VCCINT) U15.19(VCCO) U15.20(VCCJ)
GND: C83.1 C84.1 C85.1 U15.11(GND)
clk_prom: U15.3(CLK) ; port clk
prom_~{ceo}: R33.2 U15.13(~{CEO})
prom_d0_din: U15.1(D0) ; port d0_dout
prom_oe/~{reset}: U15.8(OE/~{RESET}) ; port oe/~{reset}
tck: U15.6(TCK) ; port tck
tdo1: U15.4(TDI) ; port tdi
tdo2: U15.17(TDO) ; port tdo
tms: U15.5(TMS) ; port tms
NetQ5_1: U15.10(~{CE}) ; port ~{ce}
NetR63_1: U15.7(~{CF}) ; port ~{cf}

Not connected (* = marked no-connect by the designer): U15 2(DNC) 9(DNC) 12(DNC) 14(DNC) 15(DNC) 16(DNC)

### Notes on the sheet
- Date:
- Rev:
- of
- Sheet

### Library data of the parts
C83-C85 = CAP/06035C104KAT2A: as C152 on sheet charge_pump; Supplier 1: Digi-Key; Supplier Part Number 1: 478-5052-1-ND; Manufacturer Part Number: 06035C104KAT2A; RoHS: RoHS Compliant; Category: Capacitors; Stock 1: 4412408; Pricing 1: 1=0.1, 10=0.036, 25=0.0264, 50=0.0198, 100=0.0162, 250=0.01352, 500=0.01156, 1000=0.00908 (USD); Packaging: Cut Tape (CT); Tolerance: ±10%; Voltage - Rated: 50V; Temperature Coefficient: X7R; Mounting Type: Surface Mount, MLCC; Operating Temperature: -55°C ~ 125°C; Applications: General Purpose; Ratings: -; Package / Case: 0603 (1608 Metric); Size / Dimension: 0.063" L x 0.032" W (1.60mm x 0.81mm); Height - Seated (Max): -; Thickness (Max): 0.035" (0.90mm); Lead Spacing: -; Features: -; Lead Style: -; ComponentLink1URL: http://datasheets.avx.com/X7RDielectric.pdf; ComponentLink1Description: http://datasheets.avx.com/X7RDielectric.pdf; Supplier 2: Newark; Supplier Part Number 2: 54K2412
R33 = CRCW0603330RFKEA: as R62 on sheet fpga_configuration; Supplier 1: Digi-Key; RoHS: RoHS Compliant; Category: Resistors; Stock 1: 139947; Pricing 1: 1=0.1, 10=0.011, 25=0.0084, 100=0.0047, 250=0.00356, 500=0.00286, 1000=0.0021 (USD); Packaging: Cut Tape (CT); Composition: Thick Film; Features: -; Operating Temperature: -55°C ~ 155°C; Package / Case: 0603 (1608 Metric); Supplier Device Package: 0603 (1608 Metric); Size / Dimension: 0.063" L x 0.031" W (1.60mm x 0.80mm); Height: 0.022" (0.55mm); Number of Terminations: 2; ComponentLink1URL: http://rohmfs.rohm.com/en/products/databook/datasheet/passive/resistor/chip_resistor/mcr_g.pdf; ComponentLink1Description: http://rohmfs.rohm.com/en/products/databook/datasheet/passive/resistor/chip_resistor/mcr_g.pdf; Supplier Part Number 1: RHM330CFCT-ND
U15 = XCF04SVOG20C TSSOP-20: PROM, 4M GATE, Platform Flash; Manufacturer: Xilinx Inc.; Programmable Type: In System Programmable; Memory Size: 4Mb; Voltage - Supply: 3 V ~ 3.6 V; Supplier 1: Digi-Key; Manufacturer Part Number: XCF04SVOG20C; RoHS: RoHS Compliant; Category: Integrated Circuits (ICs); Stock 1: 6188; Pricing 1: 1=7.21 (USD); Packaging: Tube; Part Status: Active; Operating Temperature: -40°C ~ 85°C; Package / Case: 20-TSSOP (0.173", 4.40mm Width); Supplier Device Package: 20-TSSOP; ComponentLink1URL: http://www.xilinx.com/support/documentation/data_sheets/ds123.pdf; ComponentLink1Description: http://www.xilinx.com/support/documentation/data_sheets/ds123.pdf; Supplier Part Number 1: 122-1288-5-ND

## Sheet jtagio.SchDoc: JTAG I/O
size A; Engineer: A. Peck; Organization: UCLA High Energy Physics; DocumentNumber: 8; Revision: 3.0; SheetNumber: 8; SheetTotal: 15; Project: LCT Comparator Tester
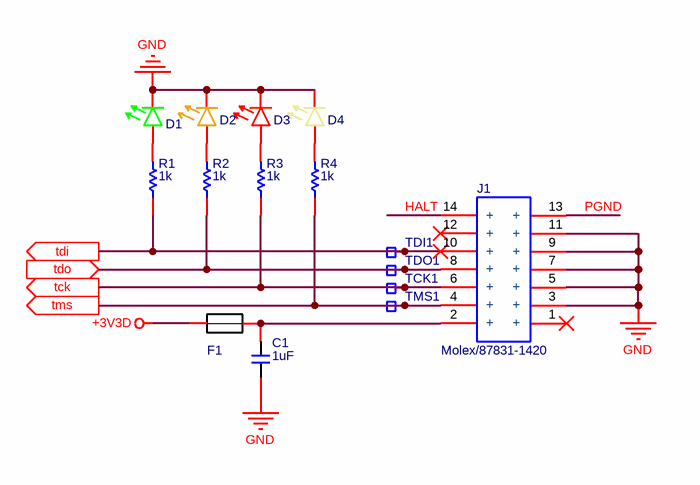
[diagram p8: jtagio.SchDoc]

### Parts
C1  1uF  [C0603]
D1  LITEON/LTST-C191KGKT  [LED0603]  (value not drawn)
D2  Vishay/TLMO1000-GS08  [LED0603]  (value not drawn)
D3  Vishay/TLMS1000-GS08  [LED0603]  (value not drawn)
D4  Vishay/TLMY1000-GS08  [LED0603]  (value not drawn)
F1  Littelfuse/1206L  [R1206]  (value not drawn)
J1  Molex/87831-1420  [Molex Milligrid 7x2]
R1  1k  [R0603]
R2  1k  [R0603]
R3  1k  [R0603]
R4  1k  [R0603]
TCK1  TP  [TP]  (value not drawn)  (no BOM)
TDI1  TP  [TP]  (value not drawn)  (no BOM)
TDO1  TP  [TP]  (value not drawn)  (no BOM)
TMS1  TP  [TP]  (value not drawn)  (no BOM)

### Ports
tck (out), tdi (out), tdo (in), tms (out)

### Nets
+3V3D: F1.1
GND: C1.2 D1.C D2.C D3.C D4.C J1.3(+) J1.5(+) J1.7(+) J1.9(+) J1.11(+)
HALT: J1.14(+)
PGND: J1.13(+)
tck: J1.6(+) R3.1 TCK1.1 ; port tck
tdi: J1.10(+) R1.1 TDI1.1 ; port tdi
tdo2: J1.8(+) R2.1 TDO1.1 ; port tdo
tms: J1.4(+) R4.1 TMS1.1 ; port tms
NetC1_1: C1.1 F1.2 J1.2(+)
NetD1_A: D1.A R1.2
NetD2_A: D2.A R2.2
NetD3_A: D3.A R3.2
NetD4_A: D4.A R4.2

Not connected (* = marked no-connect by the designer): J1 1(+)* 12(+)*

### Notes on the sheet
- Date:
- Rev:
- of
- Sheet

### Library data of the parts
C1 = Murata/GRM188R61E105KA12D: as C157 on sheet charge_pump; Supplier 1: Digi-Key; Manufacturer Part Number: GRM188R61E105KA12D; RoHS: RoHS Compliant; Category: Capacitors; Packaging: Cut Tape (CT); Tolerance: ±10%; Voltage - Rated: 25V; Mounting Type: Surface Mount, MLCC; Operating Temperature: -55°C ~ 85°C; Package / Case: 0603 (1608 Metric); Size / Dimension: 0.063" L x 0.031" W (1.60mm x 0.80mm); Height - Seated (Max): -; Lead Spacing: -; Features: -; ComponentLink1URL: http://www.murata.com/~/media/webrenewal/support/library/catalog/products/capacitor/mlcc/c02e.pdf; ComponentLink1Description: http://www.murata.com/~/media/webrenewal/support/library/catalog/products/capacitor/mlcc/c02e.pdf; Supplier Part Number 1: 490-3897-1-ND; Stock 1: 1899119; Pricing 1: 1=0.1, 10=0.036, 50=0.0196, 100=0.0165, 250=0.01352, 500=0.01156, 1000=0.009 (USD); Applications: General Purpose; Ratings: -; Thickness (Max): 0.035" (0.90mm); Lead Style: -
D1 = LITEON/LTST-C191KGKT: LED, 20mA, 0603, Green; Supplier 1: Digi-Key; Supplier Part Number 1: 160-1446-1-ND
D2 = Vishay/TLMO1000-GS08: LED, 2mA, 0603, Soft Orange; Manufacturer: Vishay Semiconductor Opto Division; Millicandela Rating: 7.5mcd; Lens Style/Size: Rectangle with Flat Top, 1.60mm x 0.80mm; Voltage - Forward (Vf) (Typ): 1.8V; Viewing Angle: 160°; Wavelength - Dominant: 605nm; Wavelength - Peak: 610nm; Supplier 1: Digi-Key; Manufacturer Part Number: TLMO1000-GS08; RoHS: RoHS Compliant; Category: Optoelectronics; Stock 1: 182; Pricing 1: 1=0.52, 10=0.372, 25=0.304, 100=0.2432, 250=0.20524, 500=0.17482, 1000=0.13682 (USD); Packaging: Cut Tape (CT); Color: Orange; Lens Color: -; Lens Transparency: -; Current - Test: 2mA; Mounting Type: Surface Mount; Features: -; Package / Case: 0603 (1608 Metric); Supplier Device Package: 0603; Size / Dimension: 1.60mm L x 0.80mm W; Height (Max): 0.65mm; ComponentLink1URL: http://www.vishay.com/docs/83172/tlmo1000.pdf; ComponentLink1Description: http://www.vishay.com/docs/83172/tlmo1000.pdf; Supplier Part Number 1: TLMO1000-GS08CT-ND
D3 = Vishay/TLMS1000-GS08: as D7 on sheet spartan6; Supplier 1: Digi-Key; Manufacturer Part Number: TLMS1000-GS08; RoHS: RoHS Compliant; Category: Optoelectronics; Stock 1: 12598; Pricing 1: 1=0.52, 10=0.372, 25=0.304, 100=0.2432, 250=0.20524, 500=0.17482, 1000=0.13682 (USD); Packaging: Cut Tape (CT); Color: Red; Lens Color: -; Lens Transparency: -; Current - Test: 2mA; Mounting Type: Surface Mount; Features: -; Package / Case: 0603 (1608 Metric); Supplier Device Package: 0603; Size / Dimension: 1.60mm L x 0.80mm W; Height (Max): 0.65mm; ComponentLink1URL: http://www.vishay.com/docs/83172/tlmo1000.pdf; ComponentLink1Description: http://www.vishay.com/docs/83172/tlmo1000.pdf; Supplier 2: Newark; Supplier Part Number 1: TLMS1000-GS08CT-ND; Supplier Part Number 2: 35M3052
D4 = Vishay/TLMY1000-GS08: LED, 2mA, 0603, Yellow; Manufacturer: Vishay Semiconductor Opto Division; Millicandela Rating: 7.5mcd; Lens Style/Size: Rectangle with Flat Top, 1.60mm x 0.80mm; Voltage - Forward (Vf) (Typ): 1.8V; Viewing Angle: 160°; Wavelength - Dominant: 588nm; Wavelength - Peak: 591nm; Supplier 1: Digi-Key; Manufacturer Part Number: TLMY1000-GS08; RoHS: RoHS Compliant; Category: Optoelectronics; Stock 1: 10152; Pricing 1: 1=0.52, 10=0.372, 25=0.304, 100=0.2432, 250=0.20524, 500=0.17482, 1000=0.13682 (USD); Packaging: Cut Tape (CT); Part Status: Active; Color: Yellow; Lens Color: -; Lens Transparency: -; Current - Test: 2mA; Mounting Type: Surface Mount; Features: -; Package / Case: 0603 (1608 Metric); Supplier Device Package: 0603; Size / Dimension: 1.60mm L x 0.80mm W; Height (Max): 0.65mm; ComponentLink1URL: http://www.vishay.com/docs/83172/tlmo1000.pdf; ComponentLink1Description: http://www.vishay.com/docs/83172/tlmo1000.pdf; Supplier Part Number 1: TLMY1000-GS08CT-ND
F1 = Littelfuse/1206L: FUSE, Resetable, 1206 Generic
J1 = Molex/87831-1420: Header 8x2 2.0mm; Manufacturer: Molex, LLC; Manufacturer Part Number: 0878311420; Connector Type: Header, Shrouded; Number of Positions: 14; Number of Positions Loaded: All; Pitch: 0.079" (2.00mm); Supplier 1: Digi-Key; RoHS: RoHS Compliant; Category: Connectors, Interconnects; Stock 1: 12951; Pricing 1: 1=1.37, 10=1.239, 25=1.1632, 50=1.1126, 100=1.062, 250=0.96084, 500=0.88498, 1000=0.75855, 2500=0.70798 (USD); Packaging: Tube; Part Status: Active; Contact Type: Male Pin; Number of Rows: 2; Row Spacing: 0.079" (2.00mm); Contact Mating Length: 0.141" (3.60mm); Mounting Type: Through Hole; Termination: Solder; Fastening Type: Latch Holder; Features: -; Contact Finish: Gold; Contact Finish Thickness: 15µin (0.38µm); Color: Black; ComponentLink1URL: http://www.molex.com/pdm_docs/sd/878311420_sd.pdf; ComponentLink1Description: http://www.molex.com/pdm_docs/sd/878311420_sd.pdf; Supplier Part Number 1: WM17469-ND
R1-R4 = CRCW06031K00FKEA: as R41 on sheet spartan6; Supplier 1: Digi-Key; Manufacturer Part Number: CRCW06031K00FKEA; RoHS: RoHS Compliant; Category: Resistors; Stock 1: 770011; Pricing 1: 1=0.1, 10=0.03, 25=0.022, 50=0.0168, 100=0.0123, 250=0.0094, 500=0.00752, 1000=0.00554, 2500=0.00481 (USD); Packaging: Cut Tape (CT); Resistance (Ohms): 1k; Composition: Thick Film; Features: Automotive AEC-Q200; Operating Temperature: -55°C ~ 155°C; Package / Case: 0603 (1608 Metric); Supplier Device Package: 0603; Size / Dimension: 0.061" L x 0.033" W (1.55mm x 0.85mm); Height: 0.020" (0.50mm); Number of Terminations: 2; ComponentLink1URL: http://www.vishay.com/docs/20035/dcrcwe3.pdf; ComponentLink1Description: http://www.vishay.com/docs/20035/dcrcwe3.pdf; Supplier 2: Newark; Supplier Part Number 1: 541-1.00KHCT-ND; Supplier Part Number 2: 52K8015
TCK1 TDI1 TDO1 TMS1 = TP: Test Point, Generic, 100MIL